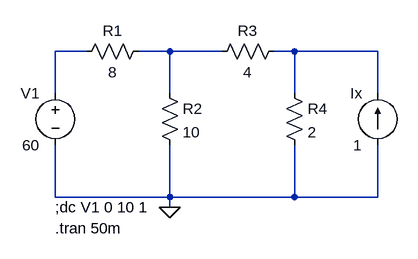
[diagram p0: schematic 2.asc]
2.asc, the LTspice schematic file:
Version 4
SHEET 1 880 680
WIRE 80 80 32 80
WIRE 208 80 160 80
WIRE 288 80 208 80
WIRE 400 80 368 80
WIRE 528 80 400 80
WIRE 32 144 32 80
WIRE 208 144 208 80
WIRE 400 144 400 80
WIRE 528 144 528 80
WIRE 32 304 32 224
WIRE 208 304 208 224
WIRE 208 304 32 304
WIRE 400 304 400 224
WIRE 400 304 208 304
WIRE 528 304 528 224
WIRE 528 304 400 304
WIRE 208 320 208 304
FLAG 208 320 0
SYMBOL voltage 32 128 M0
WINDOW 123 0 0 Left 2
WINDOW 39 0 0 Left 2
SYMATTR InstName V1
SYMATTR Value 60
SYMBOL res 192 128 R0
SYMATTR InstName R2
SYMATTR Value 10
SYMBOL res 176 64 R90
WINDOW 0 0 56 VBottom 2
WINDOW 3 32 56 VTop 2
SYMATTR InstName R1
SYMATTR Value 8
SYMBOL res 384 64 R90
WINDOW 0 0 56 VBottom 2
WINDOW 3 32 56 VTop 2
SYMATTR InstName R3
SYMATTR Value 4
SYMBOL res 384 128 R0
SYMATTR InstName R4
SYMATTR Value 2
SYMBOL current 528 224 R180
WINDOW 0 24 80 Left 2
WINDOW 3 24 0 Left 2
WINDOW 123 0 0 Left 2
WINDOW 39 0 0 Left 2
SYMATTR InstName Ix
SYMATTR Value 1
TEXT 32 320 Left 2 !;dc V1 0 10 1
TEXT 32 352 Left 2 !.tran 50m

The netlist it stands for:
* 2.asc
V1 N001 0 60
R2 N002 0 10
R1 N002 N001 8
R3 N003 N002 4
R4 N003 0 2
Ix 0 N003 1
;dc V1 0 10 1
.tran 50m
.backanno
.end